# Altium schematic sheet Green terminal 2P.schdoc
size 124 x 99 mm
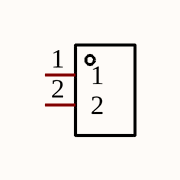
[diagram p0: Green terminal 2P.schdoc]

## Parts
U?  KF127-5.0-2P  [CONN-TH_P5.00_KF127-5.0-2P]  (value not drawn)

## Nets

Not connected (* = marked no-connect by the designer): U? 1 2

## Library data of the parts
U? = KF127-5.0-2P: Manufacturer: KEFA(科发); Add into BOM: yes; Structure: 1x2P; Pitch: 5mm; Current Rating (Max): 15A; Voltage Rating (Max): 250V; Wire Gauge - AWG: 14~26; Wire Gauge - mm2: 1.5; Number of PINs Per Row: 2; Symbol: KF127-5.0-2P; Device: KF127-5.0-2P; Supplier: LCSC; Supplier Part: C474904; Manufacturer Part: KF127-5.0-2P; JLCPCB Part Class: Extended Part; LCSC Part Name: 5mm 1x2P 排数:1 每排P数:2 直插; Supplier Footprint: 插件,P=5mm; Datasheet: https://atta.szlcsc.com/upload/public/pdf/source/20230317/A76A1969A1719ACA3DDCF692059F3CA5.pdf; Convert to PCB: yes; Color: Green; Mounting Style: Straight; Number of Pins: 2P; Number of Rows: 1; Operating Temperature Range: -40℃~+105℃